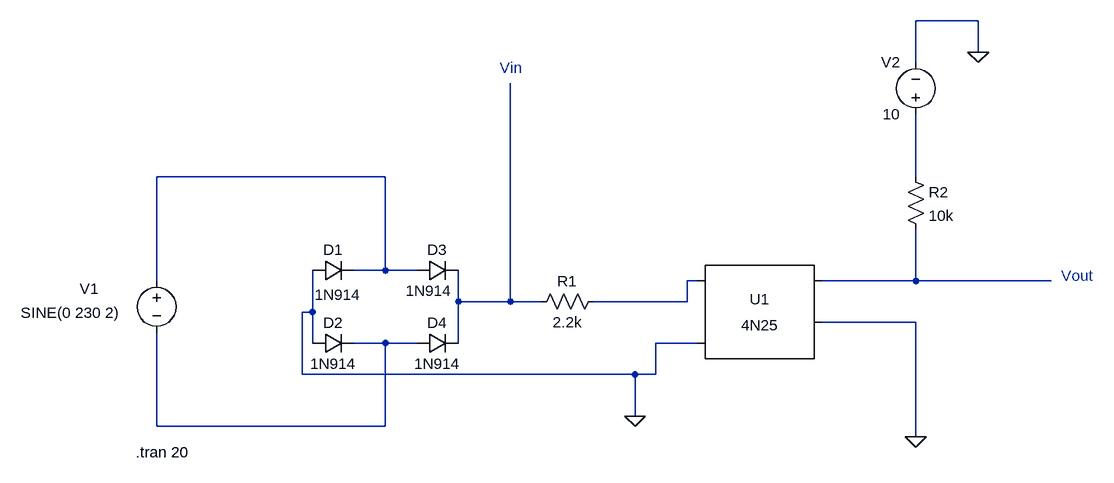
[diagram p0: schematic opto.asc]
opto.asc, the LTspice schematic file:
Version 4
SHEET 1 880 680
WIRE 496 -304 400 -304
WIRE 496 -256 496 -304
WIRE 400 -240 400 -304
WIRE -416 -64 -768 -64
WIRE 400 -64 400 -160
WIRE -416 80 -416 -64
WIRE -416 80 -464 80
WIRE -368 80 -416 80
WIRE -768 96 -768 -64
WIRE 64 96 48 96
WIRE 400 96 400 16
WIRE 400 96 256 96
WIRE 608 96 400 96
WIRE -304 128 -304 80
WIRE -224 128 -224 -208
WIRE -224 128 -304 128
WIRE -176 128 -224 128
WIRE 48 128 48 96
WIRE 48 128 -96 128
WIRE -528 144 -528 80
WIRE -528 144 -544 144
WIRE 400 160 256 160
WIRE -528 192 -528 144
WIRE -416 192 -464 192
WIRE -368 192 -416 192
WIRE -304 192 -304 128
WIRE 64 192 0 192
WIRE -544 240 -544 144
WIRE -32 240 -544 240
WIRE 0 240 0 192
WIRE 0 240 -32 240
WIRE -32 304 -32 240
WIRE -768 320 -768 176
WIRE -416 320 -416 192
WIRE -416 320 -768 320
WIRE 400 336 400 160
FLAG 400 336 0
FLAG 496 -256 0
FLAG -32 304 0
SYMBOL Optos\\4N25 160 160 R0
SYMATTR InstName U1
SYMBOL diode -528 96 R270
WINDOW 0 32 32 VTop 2
WINDOW 3 -6 39 VBottom 2
SYMATTR InstName D1
SYMATTR Value 1N914
SYMBOL diode -528 208 R270
WINDOW 0 32 32 VTop 2
WINDOW 3 0 32 VBottom 2
SYMATTR InstName D2
SYMATTR Value 1N914
SYMBOL diode -368 96 R270
WINDOW 0 32 32 VTop 2
WINDOW 3 0 19 VBottom 2
SYMATTR InstName D3
SYMATTR Value 1N914
SYMBOL diode -368 208 R270
WINDOW 0 32 32 VTop 2
WINDOW 3 0 32 VBottom 2
SYMATTR InstName D4
SYMATTR Value 1N914
SYMBOL voltage -768 80 R0
WINDOW 3 -209 65 Left 2
WINDOW 123 24 124 Left 2
WINDOW 39 0 0 Left 0
WINDOW 0 -118 28 Left 2
SYMATTR Value SINE(0 230 2)
SYMATTR InstName V1
SYMBOL voltage 400 -144 R180
WINDOW 0 24 96 Left 2
WINDOW 3 24 16 Left 2
WINDOW 123 0 0 Left 0
WINDOW 39 0 0 Left 0
SYMATTR InstName V2
SYMATTR Value 10
SYMBOL res -80 112 R90
WINDOW 0 0 56 VBottom 2
WINDOW 3 32 56 VTop 2
SYMATTR InstName R1
SYMATTR Value 2.2k
SYMBOL res 384 -80 R0
SYMATTR InstName R2
SYMATTR Value 10k
TEXT -800 360 Left 2 !.tran 20
TEXT 624 88 Left 2 ;Vout
TEXT -240 -232 Left 2 ;Vin

The netlist it stands for:
* opto.asc
XU1 N003 0 N004 0 NC_01 4N25
D1 0 N001 1N914
D2 0 N006 1N914
D3 N001 N005 1N914
D4 N006 N005 1N914
V1 N001 N006 SINE(0 230 2)
V2 N002 0 10
R1 N003 N005 2.2k
R2 N002 N004 10k
.model D D
.lib standard.dio
.tran 20
* Vout
* Vin
.lib 4N25.sub
.backanno
.end